# EAGLE design NotSoSmartWatch-BASIC-TOP-version2 (EAGLE 9.6.2)
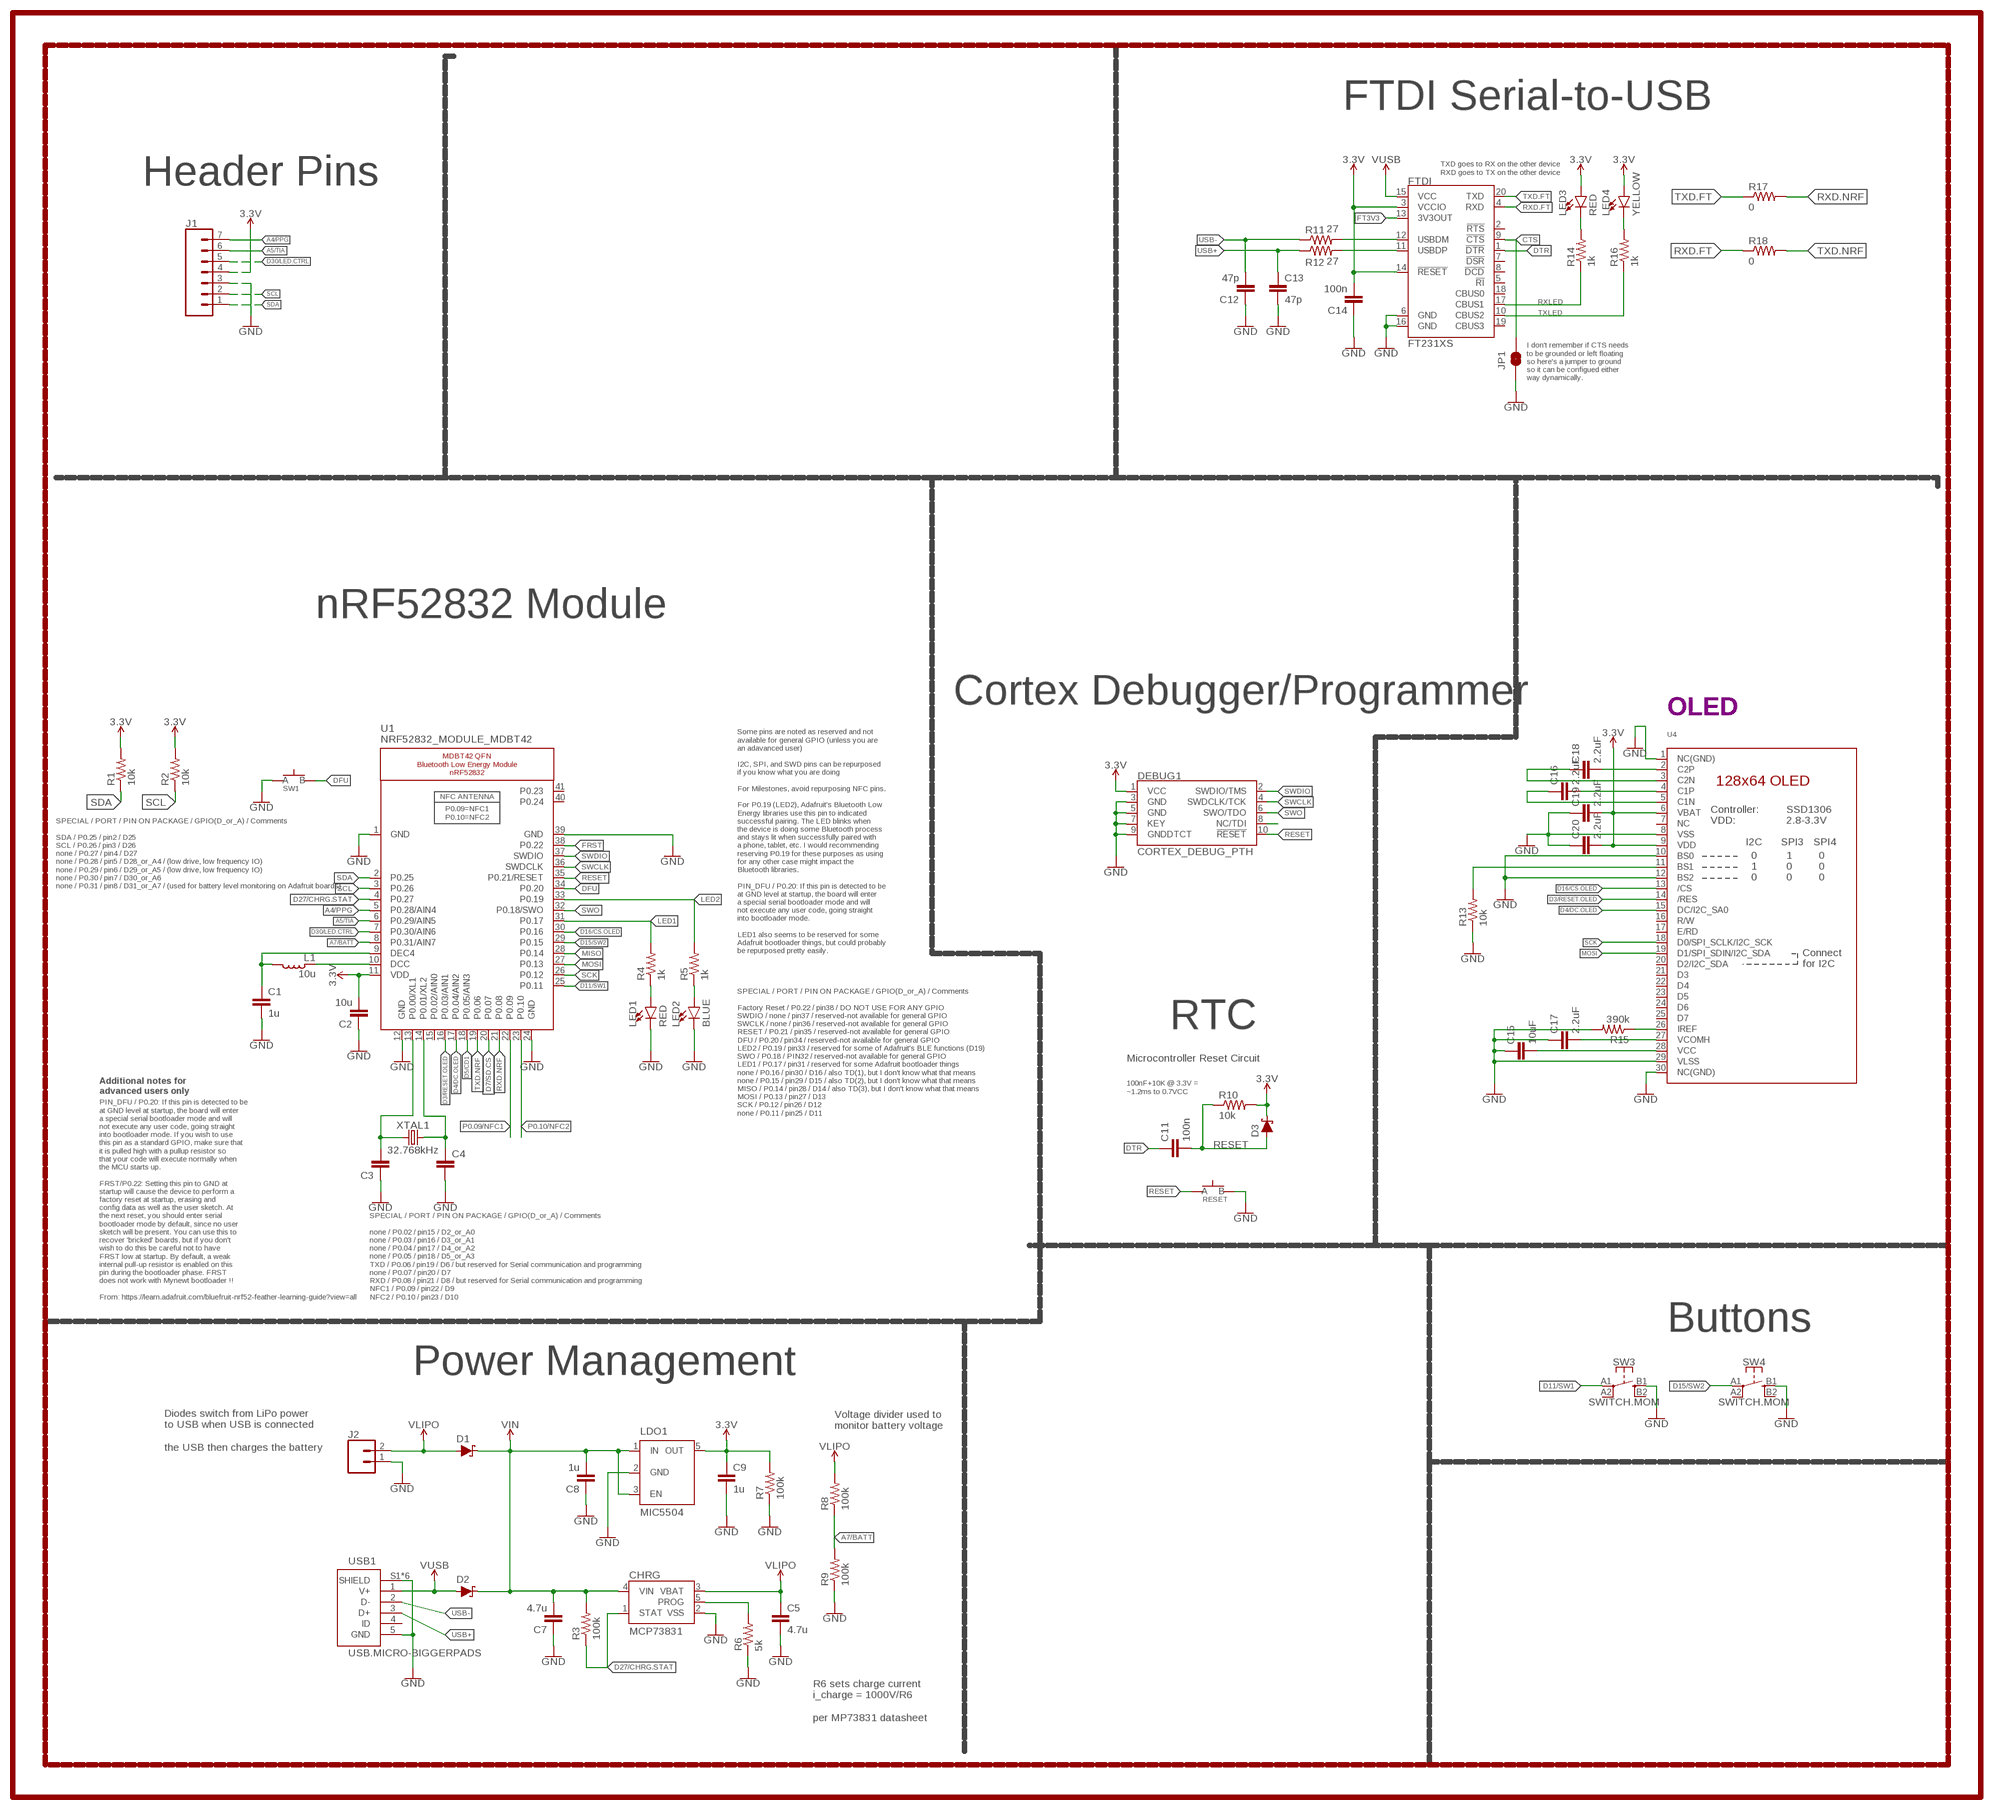
[diagram p0: schematic, sheet 1]

## Parts
C1  1u  CAPACITOR0603  [C0603]
C2  10u  CAPACITOR0805  [C0805]
C3  CAPACITOR0603  [C0603]
C4  CAPACITOR0603  [C0603]
C5  4.7u  CAPACITOR0603  [C0603]
C7  4.7u  CAPACITOR0603  [C0603]
C8  1u  CAPACITOR0603  [C0603]
C9  1u  CAPACITOR0603  [C0603]
C11  100n  CAPACITOR0603  [C0603]
C12  47p  CAPACITOR0603  [C0603]
C13  47p  CAPACITOR0603  [C0603]
C14  100n  CAPACITOR0603  [C0603]
C15  10uF  CAPACITOR0603  [C0603]
C16  2.2uF  CAPACITOR0402  [C0402]
C17  2.2uF  CAPACITOR0603  [C0603]
C18  2.2uF  CAPACITOR0402  [C0402]
C19  2.2uF  CAPACITOR0402  [C0402]
C20  2.2uF  CAPACITOR0402  [C0402]
CHRG  MCP73831  [SOT23-5]
D1  SCHOTTKY-USC  [USC]
D2  SCHOTTKY-USC  [USC]
D3  SCHOTTKY-USC  [USC]
DEBUG1  CORTEX_DEBUG_PTH  [2X5-PTH-1.27MM]
FTDI  FT231XS  [SSOP20_L]
J1  CONN_07-1.27MM  [1X07_1.27MM]
J2  CONN_02  [1X02]
JP1  JUMPER-SMT_2_NO_SILK  [SMT-JUMPER_2_NO_SILK]
L1  10u  INDUCTOR0603  [L0603]
LDO1  MIC5504  [SOT23-5]
LED1  RED  LED0603  [LED-0603]
LED2  BLUE  LED0603  [LED-0603]
LED3  RED  LED0603  [LED-0603]
LED4  YELLOW  LED0603  [LED-0603]
R1  10k  RESISTOR0603  [R0603]
R2  10k  RESISTOR0603  [R0603]
R3  100k  RESISTOR0603  [R0603]
R4  1k  RESISTOR0603  [R0603]
R5  1k  RESISTOR0603  [R0603]
R6  5k  RESISTOR0603  [R0603]
R7  100k  RESISTOR0603  [R0603]
R8  100k  RESISTOR0603  [R0603]
R9  100k  RESISTOR0603  [R0603]
R10  10k  RESISTOR0603  [R0603]
R11  27  RESISTOR0603  [R0603]
R12  27  RESISTOR0603  [R0603]
R13  10k  RESISTOR0603  [R0603]
R14  1k  RESISTOR0603  [R0603]
R15  390k  RESISTOR0603  [R0603]
R16  1k  RESISTOR0603  [R0603]
R17  0  RESISTOR0603  [R0603]
R18  0  RESISTOR0603  [R0603]
RESET  SPST-PTS830GG140-COPY.1-3  [BUTTON-GULLWING]
SW1  SPST-PTS830GG140-COPY.1-3  [BUTTON-GULLWING]
SW3  SWITCH.MOM  [TACTILE_SWITCH_SMD_6.2MM_TALL]
SW4  SWITCH.MOM  [TACTILE_SWITCH_SMD_6.2MM_TALL]
U1  NRF52832_MODULE_MDBT42  [BLE_MODULE_RAYTAC_MDBT42]
U4  DISP_OLED_UG-2864HSWEG01-NO-WRAPAROUND  [UG-2864HSWEG01_0.96IN_NO-WRAPAROUND]
USB1  USB.MICRO-BIGGERPADS  [USB-MICRO-01.BIGGERPADS]
XTAL1  32.768kHz  CRYSTALECS-.327-12.5-12-C-TR  [2-SMD.NOLEAD.2.0MMTO1.2MM]

## Nets
3.3V: C2.2 C9.1 C14.2 C19.2 C20.2 D3.-(C) DEBUG1.1(VCC) FTDI.3(VCCIO) FTDI.14(!RESET) J1.4 LDO1.5(OUT) LED3.A LED4.A R1.2 R2.2 R7.2 R10.2 U1.11(VDD) U4.6(VBAT) U4.9(VDD)
A4/PPG: J1.7 U1.5(P0.28/AIN4)
A5/TIA: J1.6 U1.6(P0.29/AIN5)
A7/BATT: R8.1 R9.2 U1.8(P0.31/AIN7)
CTS: FTDI.9(!CTS) JP1.2
D3/RESET.OLED: U1.16(P0.03/AIN1) U4.14(/RES)
D4/DC.OLED: U1.17(P0.04/AIN2) U4.15(DC/I2C_SA0)
D5/CD1: U1.18(P0.05/AIN3)
D7/SD.CS: U1.20(P0.07)
D11/SW1: SW3.A1 U1.25(P0.11)
D15/SW2: SW4.A1 U1.29(P0.15)
D16/CS.OLED: U1.30(P0.16) U4.13(/CS)
D27/CHRG.STAT: CHRG.1(STAT) R3.1 U1.4(P0.27)
D30/LED.CTRL: J1.5 U1.7(P0.30/AIN6)
DFU: SW1.3(B) U1.34(P0.20)
DTR: C11.1 FTDI.1(!DTR)
FRST: U1.38(P0.22)
FT3V3: FTDI.13(3V3OUT)
GND: C1.2 C2.1 C3.1 C4.2 C5.2 C7.1 C8.1 C9.2 C12.1 C13.2 C14.1 C15.1 C17.1 C19.1 C20.1 CHRG.2(VSS) DEBUG1.3(GND) DEBUG1.5(GND) DEBUG1.7(KEY) DEBUG1.9(GNDDTCT) FTDI.6(GND) FTDI.16(GND) J1.3 J2.1 JP1.1 LDO1.2(GND) LED1.C LED2.C R6.1 R7.1 R9.1 R13.1 R15.2 RESET.3(B) SW1.1(A) SW3.B1 SW4.B1 U1.1(GND) U1.12(GND) U1.24(GND) U1.39(GND) U4.1(NC(GND)) U4.8(VSS) U4.10(BS0) U4.12(BS2) U4.29(VLSS) U4.30(NC(GND)) USB1.5(GND) USB1.S1(SHIELD) USB1.S2(SHIELD) USB1.S3(SHIELD) USB1.S4(SHIELD) USB1.S5(SHIELD) USB1.S6(SHIELD)
LED1: R4.2 U1.31(P0.17)
LED2: R5.2 U1.33(P0.19)
MISO: U1.28(P0.14)
MOSI: U1.27(P0.13) U4.19(D1/SPI_SDIN/I2C_SDA)
N$1: R13.2 U4.11(BS1)
N$2: R15.1 U4.26(IREF)
N$3: C18.2 U4.2(C2P)
N$4: C3.2 U1.13(P0.00/XL1) XTAL1.P$1
N$5: C18.1 U4.3(C2N)
N$6: C4.1 U1.14(P0.01/XL2) XTAL1.P$2
N$7: C16.2 U4.4(C1P)
N$8: C16.1 U4.5(C1N)
N$9: LED1.A R4.1
N$10: LED2.A R5.1
N$11: L1.1 U1.10(DCC)
N$12: C1.1 L1.2 U1.9(DEC4)
N$13: C15.2 U4.28(VCC)
N$14: DEBUG1.8(NC/TDI)
N$15: C17.2 U4.27(VCOMH)
N$16: CHRG.5(PROG) R6.2
N$23: FTDI.12(USBDM) R11.2
N$24: FTDI.11(USBDP) R12.2
N$25: LED3.C R14.2
N$26: LED4.C R16.2
P0.09/NFC1: U1.22(P0.09)
P0.10/NFC2: U1.23(P0.10)
RESET: C11.2 D3.+(A) DEBUG1.10(!RESET) R10.1 RESET.1(A) U1.35(P0.21/RESET)
RXD.FT: FTDI.4(RXD) R18.1
RXD.NRF: R17.2 U1.21(P0.08)
RXLED: FTDI.17(CBUS1) R14.1
SCK: U1.26(P0.12) U4.18(D0/SPI_SCLK/I2C_SCK)
SCL: J1.2 R2.1 U1.3(P0.26)
SDA: J1.1 R1.1 U1.2(P0.25)
SWCLK: DEBUG1.4(SWDCLK/TCK) U1.36(SWDCLK)
SWDIO: DEBUG1.2(SWDIO/TMS) U1.37(SWDIO)
SWO: DEBUG1.6(SWO/TDO) U1.32(P0.18/SWO)
TXD.FT: FTDI.20(TXD) R17.1
TXD.NRF: R18.2 U1.19(P0.06)
TXLED: FTDI.10(CBUS2) R16.1
USB+: C13.1 R12.1 USB1.3(D+)
USB-: C12.2 R11.1 USB1.2(D-)
V_USB: D2.+(A) FTDI.15(VCC) USB1.1(V+) ; supply symbol labelled VUSB
VIN: C7.2 C8.2 CHRG.4(VIN) D1.-(C) D2.-(C) LDO1.1(IN) LDO1.3(EN) R3.2
VLIPO: C5.1 CHRG.3(VBAT) D1.+(A) J2.2 R8.2
Unconnected: FTDI.2(!RTS) FTDI.5(!RI) FTDI.7(!DSR) FTDI.8(!DCD) FTDI.18(CBUS0) FTDI.19(CBUS3) SW3.A2 SW3.B2 SW4.A2 SW4.B2 U1.15(P0.02/AIN0) U1.40(P0.24) U1.41(P0.23) U4.7(NC) U4.16(R/W) U4.17(E/RD) U4.20(D2/I2C_SDA) U4.21(D3) U4.22(D4) U4.23(D5) U4.24(D6) U4.25(D7) USB1.4(ID)

## Notes on the sheet
- FTDI Serial-to-USB
- TXD goes to RX on the other device
  RXD goes to TX on the other device
- Header Pins
- I don't remember if CTS needs
  to be grounded or left floating
  so here's a jumper to ground
  so it can be configued either
  way dynamically.
- nRF52832 Module
- Cortex Debugger/Programmer
- OLED
- SPECIAL / PORT / PIN ON PACKAGE / GPIO(D_or_A) / Comments
  
  SDA / P0.25 / pin2 / D25
  SCL / P0.26 / pin3 / D26
  none / P0.27 / pin4 / D27
  none / P0.28 / pin5 / D28_or_A4 / (low drive, low frequency IO)
  none / P0.29 / pin6 / D29_or_A5 / (low drive, low frequency IO)
  none / P0.30 / pin7 / D30_or_A6
  none / P0.31 / pin8 / D31_or_A7 / (used for battery level monitoring on Adafruit boards)
- Some pins are noted as reserved and not
  available for general GPIO (unless you are
  an adavanced user)
  
  I2C, SPI, and SWD pins can be repurposed
  if you know what you are doing
  
  For Milestones, avoid repurposing NFC pins.
  
  For P0.19 (LED2), Adafruit's Bluetooth Low
  Energy libraries use this pin to indicated
  successful pairing. The LED blinks when
  the device is doing some Bluetooth process
  and stays lit when successfully paired with
  a phone, tablet, etc. I would recommending
  reserving P0.19 for these purposes as using
  for any other case might impact the
  Bluetooth libraries.
  
  PIN_DFU / P0.20: If this pin is detected to be
  at GND level at startup, the board will enter
  a special serial bootloader mode and will
  not execute any user code, going straight
  into bootloader mode.
  
  LED1 also seems to be reserved for some
  Adafruit bootloader things, but could probably
  be repurposed pretty easily.
- RTC
- Microcontroller Reset Circuit
- Additional notes for
  advanced users only
- 100nF+10K @ 3.3V =
  ~1.2ms to 0.7VCC
- SPECIAL / PORT / PIN ON PACKAGE / GPIO(D_or_A) / Comments
  
  Factory Reset / P0.22 / pin38 / DO NOT USE FOR ANY GPIO
  SWDIO / none / pin37 / reserved-not available for general GPIO
  SWCLK / none / pin36 / reserved-not available for general GPIO
  RESET / P0.21 / pin35 / reserved-not available for general GPIO
  DFU / P0.20 / pin34 / reserved-not available for general GPIO
  LED2 / P0.19 / pin33 / reserved for some of Adafruit's BLE functions (D19)
  SWO / P0.18 / PIN32 / reserved-not available for general GPIO
  LED1 / P0.17 / pin31 / reserved for some Adafruit bootloader things
  none / P0.16 / pin30 / D16 / also TD(1), but I don't know what that means
  none / P0.15 / pin29 / D15 / also TD(2), but I don't know what that means
  MISO / P0.14 / pin28 / D14 / also TD(3), but I don't know what that means
  MOSI / P0.13 / pin27 / D13
  SCK / P0.12 / pin26 / D12
  none / P0.11 / pin25 / D11
- PIN_DFU / P0.20: If this pin is detected to be
  at GND level at startup, the board will enter
  a special serial bootloader mode and will
  not execute any user code, going straight
  into bootloader mode. If you wish to use
  this pin as a standard GPIO, make sure that
  it is pulled high with a pullup resistor so
  that your code will execute normally when
  the MCU starts up.
  
  FRST/P0.22: Setting this pin to GND at
  startup will cause the device to perform a
  factory reset at startup, erasing and
  config data as well as the user sketch. At
  the next reset, you should enter serial
  bootloader mode by default, since no user
  sketch will be present. You can use this to
  recover 'bricked' boards, but if you don't
  wish to do this be careful not to have
  FRST low at startup. By default, a weak
  internal pull-up resistor is enabled on this
  pin during the bootloader phase. FRST
  does not work with Mynewt bootloader !!
  
  From: https://learn.adafruit.com/bluefruit-nrf52-feather-learning-guide?view=all
- SPECIAL / PORT / PIN ON PACKAGE / GPIO(D_or_A) / Comments
  
  none / P0.02 / pin15 / D2_or_A0
  none / P0.03 / pin16 / D3_or_A1
  none / P0.04 / pin17 / D4_or_A2
  none / P0.05 / pin18 / D5_or_A3
  TXD / P0.06 / pin19 / D6 / but reserved for Serial communication and programming
  none / P0.07 / pin20 / D7
  RXD / P0.08 / pin21 / D8 / but reserved for Serial communication and programming
  NFC1 / P0.09 / pin22 / D9
  NFC2 / P0.10 / pin23 / D10
- Buttons
- Power Management
- Voltage divider used to
  monitor battery voltage
- Diodes switch from LiPo power 
  to USB when USB is connected
  
  the USB then charges the battery
- R6 sets charge current
  i_charge = 1000V/R6
  
  per MP73831 datasheet

## Library data of the parts
C1-C5 C7-C9 C11 C15-C20 = LinnesLab-Passives:CAPACITOR
C12-C14 = LinnesLab-Passives:CAPACITOR; SPICEPREFIX: C
CHRG = LinnesLab-Power:MCP73831: MCP73831T Li-Ion, Li-Pol Controller Miniature single cell, fully integrated Li-Ion, Li-polymer charge management controller Datasheet <http://ww1.microchip.com/downloads/en/DeviceDoc/20001984g.pdf> SparkFun Products: SparkFun ESP32 Thing <https://www.sparkfun.com/products/13907> SparkFun 9DoF Razor IMU M0 <https://www.sparkfun.com/products/14001>; PROD_ID: IC-09995
D1-D3 = LinnesLab-DiscreteSemi:SCHOTTKY: Schottky diode A Schottky diode is a semiconductor diode which has a low forward voltage drop and a very fast switching action. Example: Digi-Key Part Number: RB161MM-20CT-ND
DEBUG1 = LinnesLab-Connectors:CORTEX_DEBUG: Cortex Debug Connector - 10 pin Supports JTAG debug, Serial Wire debug, and Serial Wire Viewer. PTH and SMD connector options available. General Connector Information <http://infocenter.arm.com/help/topic/com.arm.doc.faqs/attached/13634/cortex_debug_connectors.pdf> Products: PTH Connector <http://www.digikey.com/product-detail/en/cnc-tech/3220-10-0100-00/1175-1627-ND/3883661> -via Digi-Key SparkFun PSoc <https://www.sparkfun.com/products/13229> SparkFun T <https://www.sparkfun.com/products/13810>
FTDI = LinnesLab-DigitalIC:FT231X: FTDI FT231X Full Speed USB to Full-handshake UART This USB2.0 Full Speed IC offers a compact bridge to full handshake UART interfaces. The device is a UART, capable of operating up to 3MBaud, with low power consumption (8mA). The FT231X includes the complete FT-X series feature set and enables USB to be added into a system design quickly and easily over a UART interface. Datasheet <http://cdn.sparkfun.com/datasheets/Components/General%20IC/DS_FT231X.pdf>; DIGIKEY: 768-1156-5-ND; MFN: FT231XS-U; SPICEPREFIX: X
J1 = LinnesLab-Connectors:CONN_07: Multi connection point. Often used as Generic Header-pin footprint for 0.1 inch spaced/style header connections On any of the 0.1 inch spaced packages, you can populate with these: Break Away Headers - Straight <https://www.sparkfun.com/products/116> (PRT-00116) Break Away Male Headers - Right Angle <https://www.sparkfun.com/products/553> (PRT-00553) Female Headers <https://www.sparkfun.com/products/115> (PRT-00115) Break Away Headers - Machine Pin <https://www.sparkfun.com/products/117> (PRT-00117) Break Away Female Headers - Swiss Machine Pin <https://www.sparkfun.com/products/743> (PRT-00743) For SCREWTERMINALS and SPRING TERMINALS visit here: Screw Terimnals on SparkFun.com <https://www.sparkfun.com/search/results?term=Screw+Terminals> (5mm/3.5mm/2.54mm spacing) This device is also useful as a general connection point to wire up your design to another part of your project. Our various solder wires solder well into these plated through hole pads. Hook-Up Wire - Assortment (Stranded, 22 AWG) <https://www.sparkfun.com/products/11375> (PRT-11375) Hook-Up Wire - Assortment (Solid Core, 22 AWG) <https://www.sparkfun.com/products/11367> (PRT-11367) View the entire wire category on our website here <https://www.sparkfun.com/categories/141> Special notes: Molex polarized connector foot print use with SKU : PRT-08231 with associated crimp pins and housings. 1MM SMD Version SKU: PRT-10208 NOTES ON THE VARIANTS LOCK and LOCK_LONGPADS... This footprint was designed to help hold the alignment of a through-hole component (i.e. 6-pin header) while soldering it into place. You may notice that each hole has been shifted either up or down by 0.005 of an inch from it's more standard position (which is a perfectly straight line). This slight alteration caused the pins (the squares in the middle) to touch the edges of the holes. Because they are alternating, it causes a "brace" to hold the component in place. 0.005 has proven to be the perfect amount of "off-center" position when using our standard breakaway headers. Although looks a little odd when you look at the bare footprint, once you have a header in there, the alteration is very hard to notice. Also,if you push a header all the way into place, it is covered up entirely on the bottom side.
J2 = LinnesLab-Connectors:CONN_02: Multi connection point. Often used as Generic Header-pin footprint for 0.1 inch spaced/style header connections On any of the 0.1 inch spaced packages, you can populate with these: Break Away Headers - Straight <https://www.sparkfun.com/products/116> (PRT-00116) Break Away Male Headers - Right Angle <https://www.sparkfun.com/products/553> (PRT-00553) Female Headers <https://www.sparkfun.com/products/115> (PRT-00115) Break Away Headers - Machine Pin <https://www.sparkfun.com/products/117> (PRT-00117) Break Away Female Headers - Swiss Machine Pin <https://www.sparkfun.com/products/743> (PRT-00743) For SCREWTERMINALS and SPRING TERMINALS visit here: Screw Terimnals on SparkFun.com <https://www.sparkfun.com/search/results?term=Screw+Terminals> (5mm/3.5mm/2.54mm spacing) This device is also useful as a general connection point to wire up your design to another part of your project. Our various solder wires solder well into these plated through hole pads. Hook-Up Wire - Assortment (Stranded, 22 AWG) <https://www.sparkfun.com/products/11375> (PRT-11375) Hook-Up Wire - Assortment (Solid Core, 22 AWG) <https://www.sparkfun.com/products/11367> (PRT-11367) View the entire wire category on our website here <https://www.sparkfun.com/categories/141> Special notes: Molex polarized connector foot print use with: PRT-08233 with associated crimp pins and housings. 2.54_SCREWTERM for use with PRT-10571. 3.5mm Screw Terminal footprints for PRT-08084 5mm Screw Terminal footprints for use with PRT-08432
JP1 = LinnesLab-Switches:JUMPER-SMT_2_NO: Normally open jumper This jumper has two pads in close proximity to each other. Apply solder to close the connection. Round pads are easier to solder for beginners, but are a lot larger. SparkFun Product that uses the round pads: SparkFun EL Sequencer <https://www.sparkfun.com/products/12781>; SPICEPREFIX: B
L1 = LinnesLab-Passives:INDUCTOR
LDO1 = LinnesLab-Power:MIC5504: MIC5504 Voltage Regulator Output Voltages: 1.0V to 3.3V Input Voltages: 2.5V to 5.5V Link to Datasheet http://ww1.microchip.com/downloads/en/DeviceDoc/MIC550X.pdf
LED1 LED2 = LinnesLab-LED:LED: LED (Generic) Standard schematic elements and footprints for 5mm, 3mm, 1206, and 0603 sized LEDs. Generic LEDs with no color specified. LTST-C190KGKT: arrow indicates cathode
LED3 LED4 = LinnesLab-LED:LED: LED (Generic) Standard schematic elements and footprints for 5mm, 3mm, 1206, and 0603 sized LEDs. Generic LEDs with no color specified. LTST-C190KGKT: arrow indicates cathode; SPICEPREFIX: L
R1-R10 R13 R15 R17 R18 = LinnesLab-Passives:RESISTOR
R11 R12 R14 R16 = LinnesLab-Passives:RESISTOR; SPICEPREFIX: R
RESET SW1 = LinnesLab-Switches:SPST-PTS830GG140-COPY
SW3 SW4 = LinnesLab-Switches:SWITCH.MOM: PTS645SM43SMTR92 LFS
U1 = LinnesLab-Microcontrollers:NRF52832_MODULE_MDBT42: MDBT42 - BLE Module (nRF52832 QFN) VDD: 1.7-3.6V
U4 = LinnesLab-Displays:DISP_OLED_UG-2864HSWEG01: UG-2864HSWEG01 OLED display Both 1.3" and 0.96" models share the same FPC tab footprint, only the screen dimensions vary.
USB1 = LinnesLab-Connectors:USB.MICRO: DigiKey PN: 609-4613-1-ND
XTAL1 = LinnesLab-Clocks:CRYSTAL; DIGIKEY: XC2288CT-ND; FREQ: 32.7680KHZ; LOAD_CAP: 12.5pF

## Board
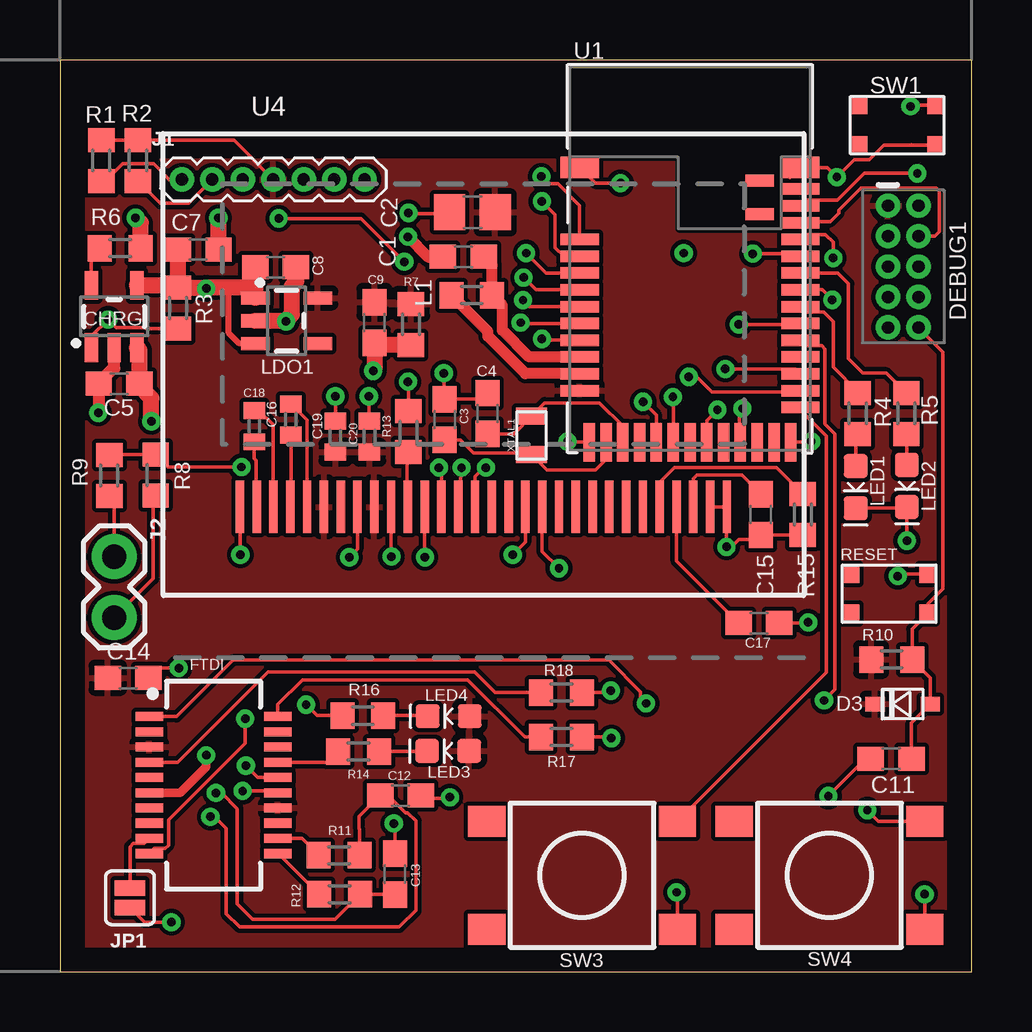
[diagram p1: board, top side]
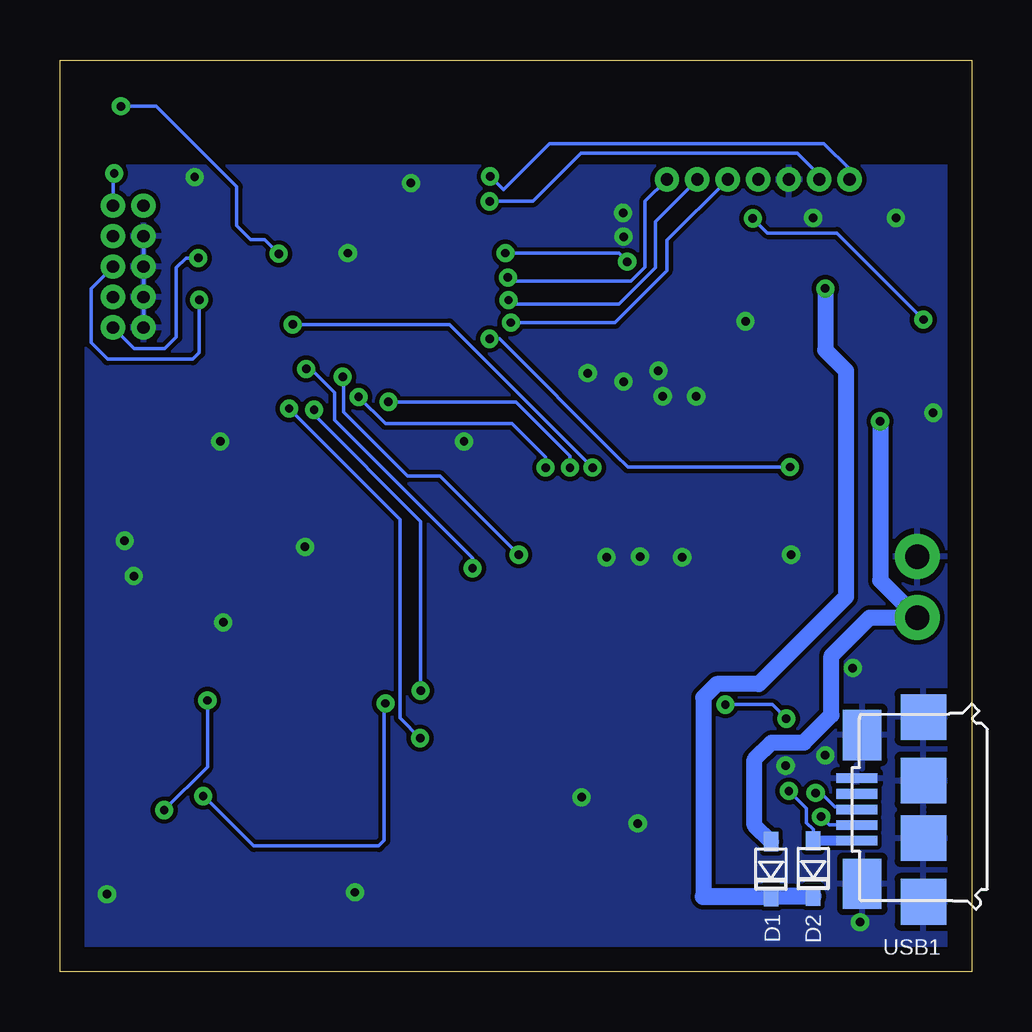
[diagram p2: board, bottom side, seen from below]

Size 38 x 38 mm. Coordinates in mm from the lower left corner, seen from the top.
Outline: 0,0 38,0 38,38 0,38 0,0
Copper layers (1*16): Top 0.035mm / dielectric 1.5mm / Bottom 0.035mm
Design rules "default": minimum track width 6mil, minimum drill 0.35mm, track to track 6mil, track to pad 6mil, pad to pad 6mil, via to via 6mil, smd to smd 6mil, copper to edge 40mil, drill to drill 6mil, minimum pad ring 10mil, minimum via ring 8mil, stop-mask expansion 4mil, vias tented up to drill 0mil, thermal gap 10mil

### Footprints (pad centres in the part's own frame; a part is rotated, then mirrored left to right if it is on the bottom)
C0603 = smd 1.1 x 1: 1 -0.85,0; 2 0.85,0
C0805 = smd 1.3 x 1.5: 1 -0.95,0; 2 0.95,0
C0402 = smd 0.7 x 0.9: 1 -0.65,0; 2 0.65,0
SOT23-5 = smd 0.55 x 1.2: 1 -0.95,-1.3; 2 0,-1.3; 3 0.95,-1.3; 4 0.95,1.3; 5 -0.95,1.3
USC = smd 0.8 x 0.6: + -1.15,0; - 1.15,0
2X5-PTH-1.27MM = drill 0.508 pad 1: 1 -2.54,-0.635; 2 -2.54,0.635; 3 -1.27,-0.635; 4 -1.27,0.635; 5 0,-0.635; 6 0,0.635; 7 1.27,-0.635; 8 1.27,0.635; 9 2.54,-0.635; 10 2.54,0.635
SSOP20_L = smd 0.381 x 1.143: 1 -2.857,-2.68; 2 -2.223,-2.68; 3 -1.587,-2.68; 4 -0.953,-2.68; 5 -0.318,-2.68; 6 0.318,-2.68; 7 0.953,-2.68; 8 1.587,-2.68; 9 2.223,-2.68; 10 2.857,-2.68; 11 2.857,2.68; 12 2.223,2.68; 13 1.587,2.68; 14 0.953,2.68; 15 0.318,2.68; 16 -0.318,2.68; 17 -0.953,2.68; 18 -1.587,2.68; 19 -2.223,2.68; 20 -2.857,2.68
1X07_1.27MM = drill 0.508 pad 1: 1 0,0; 2 1.27,0; 3 2.54,0; 4 3.81,0; 5 5.08,0; 6 6.35,0; 7 7.62,0
1X02 = drill 1.016 pad 1.88: 1 0,0; 2 2.54,0
SMT-JUMPER_2_NO_SILK = smd 0.635 x 1.27: 1 -0.406,0; 2 0.406,0
L0603 = smd 1 x 1.1: 1 -0.85,0; 2 0.85,0
LED-0603 = smd 1 x 1: A -0.877,0; C 0.877,0
R0603 = smd 1 x 1.1: 1 -0.85,0; 2 0.85,0
BUTTON-GULLWING = smd 0.7 x 0.75: 1 -1.6,0.825; 2 1.6,0.825; 3 -1.6,-0.825; 4 1.6,-0.825
TACTILE_SWITCH_SMD_6.2MM_TALL = smd 1.55 x 1.3: A1 -3.975,-2.25; A2 3.975,-2.25; B1 -3.975,2.25; B2 3.975,2.25
BLE_MODULE_RAYTAC_MDBT42 = smd 1.6 x 0.9: 1 -4.6,3.8; 39 4.6,3.8 | smd 1.6 x 0.48: 2 -4.6,0.8; 3 -4.6,0.1; 4 -4.6,-0.6; 5 -4.6,-1.3; 6 -4.6,-2; 7 -4.6,-2.7; 8 -4.6,-3.4; 9 -4.6,-4.1; 10 -4.6,-4.8; 11 -4.6,-5.5; 25 4.6,-6.2; 26 4.6,-5.5; 27 4.6,-4.8; 28 4.6,-4.1; 29 4.6,-3.4; 30 4.6,-2.7; 31 4.6,-2; 32 4.6,-1.3; 33 4.6,-0.6; 34 4.6,0.1; 35 4.6,0.8; 36 4.6,1.5; 37 4.6,2.2; 38 4.6,2.9 | smd 0.48 x 1.6: 12 -4.2,-7.65; 13 -3.5,-7.65; 14 -2.8,-7.65; 15 -2.1,-7.65; 16 -1.4,-7.65; 17 -0.7,-7.65; 18 0,-7.65; 19 0.7,-7.65; 20 1.4,-7.65; 21 2.1,-7.65; 22 2.8,-7.65; 23 3.5,-7.65; 24 4.2,-7.65 | smd 1.2 x 0.5: 40 2.9,3.25; 41 2.9,1.85
UG-2864HSWEG01_0.96IN_NO-WRAPAROUND = smd 0.35 x 2.2: 1 -10.15,-1.2; 2 -9.45,-1.2; 3 -8.75,-1.2; 4 -8.05,-1.2; 5 -7.35,-1.2; 6 -6.65,-1.2; 7 -5.95,-1.2; 8 -5.25,-1.2; 9 -4.55,-1.2; 10 -3.85,-1.2; 11 -3.15,-1.2; 12 -2.45,-1.2; 13 -1.75,-1.2; 14 -1.05,-1.2; 15 -0.35,-1.2; 16 0.35,-1.2; 17 1.05,-1.2; 18 1.75,-1.2; 19 2.45,-1.2; 20 3.15,-1.2; 21 3.85,-1.2; 22 4.55,-1.2; 23 5.25,-1.2; 24 5.95,-1.2; 25 6.65,-1.2; 26 7.35,-1.2; 27 8.05,-1.2; 28 8.75,-1.2; 29 9.45,-1.2; 30 10.15,-1.2
USB-MICRO-01.BIGGERPADS = smd 0.4 x 1.7: 1 -1.3,1.505; 2 -0.65,1.505; 3 0,1.505; 4 0.65,1.505; 5 1.3,1.505 | smd 1.9 x 1.9: S1 -3.85,-1.27; S2 -1.2,-1.27; S3 1.2,-1.27; S4 3.85,-1.27 | smd 2.1 x 1.6: S5 -3.1,1.28; S6 3.1,1.28
2-SMD.NOLEAD.2.0MMTO1.2MM = smd 0.7 x 1.3: P$1 -0.8,0; P$2 0.8,0

### Placement (x,y rotation side)
C1  16.81,29.79 180 top
C2  17.2,31.65 0 top
C3  16.03,23.01 270 top
C4  17.83,23.27 90 top
C5  2.46,24.51 180 top
C7  5.77,30.1 180 top
C8  8.99,29.36 180 top
C9  13.11,27.05 270 top
C11  34.65,8.86 0 top
C12  14.2,7.34 180 top
C13  13.97,4.06 90 top
C14  2.84,12.24 180 top
C15  29.21,19.05 90 top
C16  9.63,23.01 270 top
C17  29.13,14.53 180 top
C18  8.1,22.73 270 top
C19  11.48,22.3 270 top
C20  12.9,22.3 270 top
CHRG  2.26,27.3 0 top
D1  8.36,4.27 270 bottom
D2  6.6,4.29 270 bottom
D3  35.13,11.15 180 top
DEBUG1  35.15,29.39 270 top
FTDI  6.4,7.77 270 top
J1  5.08,33.02 0 top
J2  2.26,17.3 270 top
JP1  2.92,3.07 90 top
L1  17.17,28.19 0 top
LDO1  9.45,27.13 270 top
LED1  33.17,20.19 270 top
LED2  35.31,20.24 270 top
LED3  16.18,9.19 180 top
LED4  16.21,10.64 180 top
R1  1.73,33.81 90 top
R2  3.25,33.81 90 top
R3  4.93,27.66 90 top
R4  33.25,23.27 90 top
R5  35.28,23.27 90 top
R6  2.51,30.15 180 top
R7  14.63,26.97 90 top
R8  3.99,20.7 270 top
R9  2.06,20.68 90 top
R10  34.67,13 180 top
R11  11.63,4.85 180 top
R12  11.66,3.23 180 top
R13  14.53,22.5 270 top
R14  12.45,9.17 0 top
R15  30.96,19.05 270 top
R16  12.62,10.67 0 top
R17  20.9,9.78 0 top
R18  20.9,11.63 0 top
RESET  34.57,15.75 180 top
SW1  34.9,35.28 180 top
SW3  21.77,4.01 180 top
SW4  32.08,4.01 180 top
U1  26.26,29.72 0 top
U4  17.65,20.57 0 top
USB1  3.28,6.76 90 bottom
XTAL1  19.66,22.35 90 top

### Tracks (layer width: path | path; a pad name or v marks a point on that pad's centre or on a via)
3.3V
  Top 0.152: R1.2 R2.2 7.25,34.66 J1.4
  pour Top (isolate 0.178): 37.72,33.83 0.33,33.83 0.33,0.41 37.72,0.41
A4/PPG  (via drill 0.35)
  Top 0.152: U1.5 19.84,28.42 v19.33,28.93
  Bottom 0.152: v19.33,28.93 19.18,28.78 14.2,28.78 13.61,29.36 13.61,32.11 J1.7
A5/TIA  (via drill 0.35)
  Top 0.152: U1.6 19.58,27.72 v19.3,27.99
  Bottom 0.152: v19.3,27.99 19.13,27.81 14.71,27.81 13.18,29.34 13.18,31.27 J1.6
A7/BATT  (via drill 0.35)
  Top 0.152: v7.57,21.03 4.51,21.03 R8.1 2.08,21.55 R9.2 | v20.09,26.38 20.15,26.32 U1.8
  Bottom 0.152: v7.57,21.03 14.33,21.03 14.83,21.54 19.67,26.38 v20.09,26.38
CTS
  Top 0.152: FTDI.9 3.5,5.33 3.06,5.33 2.92,5.2 JP1.2
D3/RESET.OLED  (via drill 0.35)
  Top 0.152: v16.74,21.01 16.62,19.39 U4.14 | U1.16 24.86,23.19 v24.31,23.75
  Bottom 0.152: v24.31,23.75 19,23.75 16.74,21.49 v16.74,21.01
D4/DC.OLED  (via drill 0.35)
  Top 0.152: U4.15 17.3,20.63 17.68,21.01 v17.75,21.01 | U1.17 25.56,23.94 v25.55,23.95
  Bottom 0.152: v25.55,23.95 24.43,22.84 19.15,22.84 17.75,21.44 v17.75,21.01
D11/SW1
  Top 0.152: U1.25 30.86,23.41 31.95,22.32 31.95,12.47 SW3.A1
D15/SW2  (via drill 0.35)
  Top 0.152: U1.29 31.09,26.09 31.76,26.09 31.89,25.95 31.89,22.81 32.31,22.4 32.31,11.76 v31.85,11.3 | SW4.A1 34.12,6.26 v33.66,6.73
  Bottom 0.152: v33.66,6.73 31.85,8.53 v31.85,11.3
D16/CS.OLED  (via drill 0.35)
  Top 0.152: U4.13 15.9,20.9 v15.8,21.01 | U1.30 30.82,26.98 v28.3,26.98
  Bottom 0.152: v28.3,26.98 21.77,26.98 v15.8,21.01
D27/CHRG.STAT  (via drill 0.35)
  Top 0.152: U1.4 20.26,29.12 v19.43,29.95 | CHRG.1 1.31,26.48 v2.01,27.18 2.35,26.83 3.58,26.83 3.6,26.81 R3.1 | v14.35,29.59 12.55,31.39 v9.12,31.39
  Bottom 0.152: v2.01,27.18 5.61,30.79 8.51,30.79 v9.12,31.39 | v19.43,29.95 14.71,29.95 v14.35,29.59
D30/LED.CTRL  (via drill 0.35)
  Top 0.152: U1.7 19.23,27.02 v19.2,27.05
  Bottom 0.152: v19.2,27.05 14.86,27.05 12.7,29.21 12.7,30.48 J1.5
DFU  (via drill 0.35)
  Top 0.152: SW1.3 35.5,36.11 v35.46,36.07 | v28.88,29.92 30.76,29.92 U1.34
  Bottom 0.152: v35.46,36.07 33.98,36.07 30.63,32.72 30.63,31.09 30.05,30.5 29.46,30.5 v28.88,29.92
DTR  (via drill 0.35)
  Top 0.152: FTDI.1 4.86,10.63 7.21,12.98 22.89,12.98 24.21,11.66 24.21,11.4 v24.43,11.18 | v32.03,7.32 33.58,8.87 C11.1
  Bottom 0.152: v24.43,11.18 24.49,11.12 24.49,5.46 24.71,5.23 29.92,5.23 32,7.32 v32.03,7.32
GND  (via drill 0.35, 0.35 pad 0.51)
  Top 0.152: U4.1 7.5,17.39 v7.52,17.37 | v14.5,24.59 14.53,24.56 R13.1 | C19.1 v11.48,23.98 | C20.1 12.88,22.98 v12.88,23.98 | U4.8 12.4,17.61 v12.06,17.27 | U4.10 13.8,17.31 v13.82,17.3 | U4.12 15.2,17.28 v15.21,17.27 | U4.29 U4.30 27.78,19.35 27.78,17.71 v27.79,17.7 27.99,17.7 28.3,18.01 29.02,18.01 C15.1 R15.2 | C12.1 15.23,7.21 16.26,7.21 v16.26,7.26 | C13.2 13.97,6.12 v13.92,6.17 | J2.1 2.26,19.62 R9.1 | C4.2 17.58,23.86 C3.1 16,23.89 v16,24.94 | U1.12 21.19,22.07 v21.16,22.1 | LED1.C 35.26,19.32 LED2.C v35.31,17.96 | v34.92,16.48 35.01,16.57 RESET.3 | SW3.B1 25.74,3.26 v25.7,3.3 | SW4.B1 36.05,3.21 v36.04,3.23 | U1.24 31.29,22.07 v31.32,22.1 | C17.1 31.17,14.53 v31.19,14.55 | SW1.1 35.5,34.46 | 35.48,34.47 35.5,34.46 | C2.1 16.2,31.6 14.55,31.6 v14.53,31.62 | U1.1 22.31,32.87 v23.37,32.87 | JP1.1 3.53,2.06 v4.65,2.06 | FTDI.16 8.24,8.09 v7.75,8.59 | C14.1 4.1,12.65 v4.95,12.65 | 30.43,33.09 U1.39 31.99,33.52 v32.38,33.12 33.12,33.85 33.74,33.85 34.35,34.46 35.5,34.46
  Top 0.356: v6.1,9.02 6.1,8.53 5.02,7.46 FTDI.6
  Top 0.457: C1.2 15.94,29.77 15.37,29.77 v14.5,30.63
  Top 0.508: CHRG.2 2.26,25.15 2.25,25.15 C5.2 1.61,23.3 v1.6,23.29
  Top 0.66: R6.1 3.37,31.2 v3.15,31.42 | C7.1 6.62,31.41 v6.6,31.42 | C9.2 13.08,26.23 | LDO1.2 9.4,27.13 | 9.4,27.13 v9.42,27.1 | C8.1 9.84,28.73 9.67,28.55 9.67,27.39 9.4,27.13 | R7.1 13.18,26.12 C9.2 | C9.2 13.11,25.09 v13.06,25.04
  Bottom 0.152: DEBUG1.3 DEBUG1.5 DEBUG1.7 DEBUG1.9
  other vias: 26,29.95
  pour Bottom (isolate 0.178): 37.34,33.58 0.56,33.58 0.56,0.71 37.34,0.71
LED1
  Top 0.152: R4.2 33.25,24.18 32.23,25.2 32.23,27.1 31.84,27.49 31.09,27.49 U1.31
LED2
  Top 0.152: R5.2 34.45,24.94 33.48,24.94 32.87,25.55 32.87,28.67 32.42,29.12 U1.33
MOSI  (via drill 0.35)
  Top 0.152: U4.19 20.1,17.51 v20.8,16.82 | U1.27 30.66,25.12 v27.74,25.12
  Bottom 0.152: v20.8,16.82 20.8,17.25 26.54,22.99 26.54,24.13 27.53,25.12 v27.74,25.12
N$1
  Top 0.152: R13.2 14.48,21.6 14.48,19.4 U4.11
N$2
  Top 0.152: U4.26 25,20.41 25.61,21.01 28.83,21.01 29.86,21.01 R15.1
N$3
  Top 0.152: C18.2 8.1,21.39 8.18,21.31 8.18,19.4 U4.2
N$4
  Top 0.152: U1.13 22.76,21.34 22.33,20.9 20.31,20.9 XTAL1.P$1 19.6,21.61 17.25,21.61 16.7,22.16 C3.2
N$5
  Top 0.152: U4.3 8.88,19.4 8.88,22.8 8.29,23.38 C18.1
N$6
  Top 0.152: U1.14 23.46,22.73 22.5,23.7 20.21,23.7 XTAL1.P$2 18.92,22.42 C4.1
N$7
  Top 0.152: U4.4 9.64,19.41 C16.2
N$8
  Top 0.152: U4.5 10.3,21.92 10.3,22.98 C16.1
N$9
  Top 0.152: LED1.A 33.17,22.34 R4.1
N$10
  Top 0.152: LED2.A 35.31,22.39 R5.1
N$11
  Top 0.457: L1.1 17.83,26.68 17.83,26.48 19.4,24.92 U1.10
N$12
  Top 0.457: C1.1 18.02,29.44 L1.2 18.44,27.77 18.44,26.74 19.56,25.62 U1.9
N$13
  Top 0.152: U4.28 26.4,20.56 26.55,20.7 28.42,20.7 29.21,19.91 C15.2
N$15
  Top 0.152: C17.2 25.7,17.11 U4.27
N$16
  Top 0.152: CHRG.5 1.31,29.8 R6.2
N$23
  Top 0.152: R11.2 10.09,5.55 FTDI.12
N$24
  Top 0.152: FTDI.11 9.12,4.92 R12.2
N$25
  Top 0.152: LED3.C 15.28,9.17 R14.2
N$26
  Top 0.152: LED4.C 15.3,10.67 R16.2
RESET  (via drill 0.35)
  Top 0.152: C11.2 35.5,10.37 D3.+ 36.28,12.25 R10.1 35.52,14.28 RESET.1 36.17,15.32 36.8,15.96 36.8,25.83 DEBUG1.10 | U1.35 31.07,30.72 31.91,30.72 32.23,30.4 v32.23,29.74
  Bottom 0.152: DEBUG1.10 34.9,25.96 33.63,25.96 33.15,26.44 33.15,29.34 32.74,29.74 v32.23,29.74
RXD.FT
  Top 0.152: R18.1 18.14,11.63 17.27,12.5 8.68,12.5 4.9,8.72 4.89,8.72 FTDI.4
RXD.NRF  (via drill 0.35)
  Top 0.152: R17.2 22.94,9.78 v22.99,9.73 | U1.21 28.32,22.11 28.32,23.34 v28.45,23.47
  Bottom 0.152: v22.99,9.73 23.82,10.57 23.82,18.85 v28.45,23.47
RXLED
  Top 0.152: FTDI.17 11.15,8.72 R14.1
SCK  (via drill 0.35)
  Top 0.152: U4.18 19.4,17.9 v18.87,17.37 | U1.26 30.85,24.23 30.77,24.16 27.18,24.16 26.54,24.79 v26.21,24.79
  Bottom 0.152: v18.87,17.37 22.15,20.65 23.52,20.65 26.19,23.32 26.19,24.77 v26.21,24.79
SCL  (via drill 0.35)
  Top 0.152: v20.09,32.11 20.64,31.56 20.64,30.18 21,29.82 U1.3 | R2.1 4.18,32.03 5.36,32.03 J1.2
  Bottom 0.152: v20.09,32.11 18.29,32.11 16.28,34.11 7.26,34.11 6.35,33.2 J1.2
SDA  (via drill 0.35)
  Top 0.152: U1.2 21.66,31.93 20.75,32.84 20.37,32.84 v20.07,33.15 | R1.1 1.88,32.96 2.61,33.69 3.9,33.69 4.56,33.02 J1.1
  Bottom 0.152: v20.07,33.15 19.52,32.6 17.6,34.52 6.15,34.52 5.08,33.45 J1.1
SWCLK
  Top 0.152: U1.36 30.91,31.27 32.11,31.27 32.46,31.62 32.46,31.75 33.38,32.66 36.52,32.66 36.65,32.54 36.65,30.84 36.47,30.66 DEBUG1.4
SWDIO  (via drill 0.35)
  Top 0.152: U1.37 31.09,32.15 32.16,32.15 32.17,32.16 32.41,32.16 33.52,33.27 v35.74,33.27
  Bottom 0.152: v35.74,33.27 35.79,33.22 DEBUG1.2
SWO  (via drill 0.35)
  Top 0.152: U1.32 31.77,28.42 v32.19,28
  Bottom 0.152: DEBUG1.6 36.7,28.47 36.7,26.21 36.02,25.53 32.46,25.53 32.19,25.79 v32.19,28
TXD.FT
  Top 0.152: R17.1 19.38,9.78 16.99,12.17 10.11,12.17 9.08,11.14 FTDI.20
TXD.NRF  (via drill 0.35)
  Top 0.152: R18.2 22.89,11.63 v22.96,11.71 | U1.19 26.96,22.98 v27.41,23.42
  Bottom 0.152: v27.41,23.42 27.41,23.22 22.96,18.77 v22.96,11.71
TXLED  (via drill 0.35)
  Top 0.152: R16.1 10.72,10.67 v10.26,11.12 | FTDI.10 3.94,5.13 4.39,5.13 4.52,5.26 4.52,6.32 7.72,9.52 v7.72,10.54
  Bottom 0.152: v10.26,11.12 8.31,11.12 v7.72,10.54
USB+  (via drill 0.35 pad 0.51)
  Top 0.152: C13.1 13.96,3.23 R12.1 11.47,2.18 8.03,2.18 7.39,2.82 7.39,6.78 6.73,7.44 v6.5,7.44
  Bottom 0.152: USB1.3 4.88,6.86 5.69,6.86 6.27,7.44 v6.5,7.44
USB-  (via drill 0.35 pad 0.51)
  Top 0.152: v6.27,6.45 6.45,6.45 6.93,5.97 6.93,2.41 7.49,1.85 14.14,1.85 14.83,2.54 14.83,6.27 14.49,6.61 14.4,6.61 13.68,7.34 C12.2 12.47,6.46 12.47,5.94 12.48,5.93 R11.1
  Bottom 0.152: USB1.2 5.93,6.11 v6.27,6.45
V_USB  (via drill 0.35)
  Top 0.152: v7.61,7.53 9.01,7.53 FTDI.15
  Bottom 0.152: D2.+ 6.6,5.92 6.88,6.2 6.88,6.79 v7.61,7.53
  Bottom 0.406: USB1.1 5.5,5.46 D2.+
VIN  (via drill 0.35)
  Top 0.254: LDO1.3 7.48,26.18 7.04,26.62 7.04,28.51
  Top 0.66: CHRG.4 4.83,28.61 | 4.83,28.61 R3.2 6.06,28.51 | C7.2 4.92,28.69 4.83,28.61 | 6.06,28.51 v6.1,28.47 | 6.06,28.51 7.04,28.51 7.71,28.51 LDO1.1 C8.2
  Bottom 0.66: v6.1,28.47 6.1,25.91 5.24,25.05 5.24,15.62 8.87,11.99 10.62,11.99 11.18,11.42 11.18,3.12
  Bottom 0.711: D2.- 8.33,3.14 D1.- 11.18,3.12
VLIPO  (via drill 0.35)
  Top 0.152: J2.2 3.89,16.38 3.89,19.75 R8.2
  Top 0.66: CHRG.3 3.31,25.9 C5.1 3.31,24.4 3.81,23.9 v3.81,22.94
  Bottom 0.66: v3.81,22.94 3.81,16.31 J2.2 4.24,14.76 5.84,13.16 5.84,10.69 6.99,9.55 8.33,9.55 9.04,8.84 9.04,6.1 D1.+